# EAGLE design FPC (EAGLE 6.5.0)
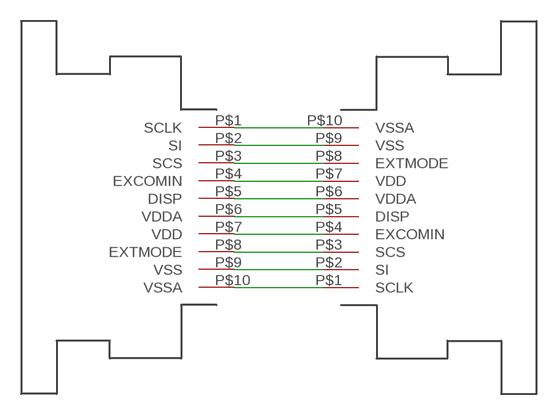
[diagram p0: schematic, sheet 1]

## Parts
U$1  52745-1097  [52745-1097]
U$2  52745-1097  [52745-1097]

## Nets
N$1: U$1.P$10(VSSA) U$2.P$1(SCLK)
N$2: U$1.P$9(VSS) U$2.P$2(SI)
N$3: U$1.P$8(EXTMODE) U$2.P$3(SCS)
N$4: U$1.P$7(VDD) U$2.P$4(EXCOMIN)
N$5: U$1.P$6(VDDA) U$2.P$5(DISP)
N$6: U$1.P$5(DISP) U$2.P$6(VDDA)
N$7: U$1.P$4(EXCOMIN) U$2.P$7(VDD)
N$8: U$1.P$3(SCS) U$2.P$8(EXTMODE)
N$9: U$1.P$2(SI) U$2.P$9(VSS)
N$10: U$1.P$1(SCLK) U$2.P$10(VSSA)

## Library data of the parts
U$1 U$2 = KW2:52745-1097

## Board
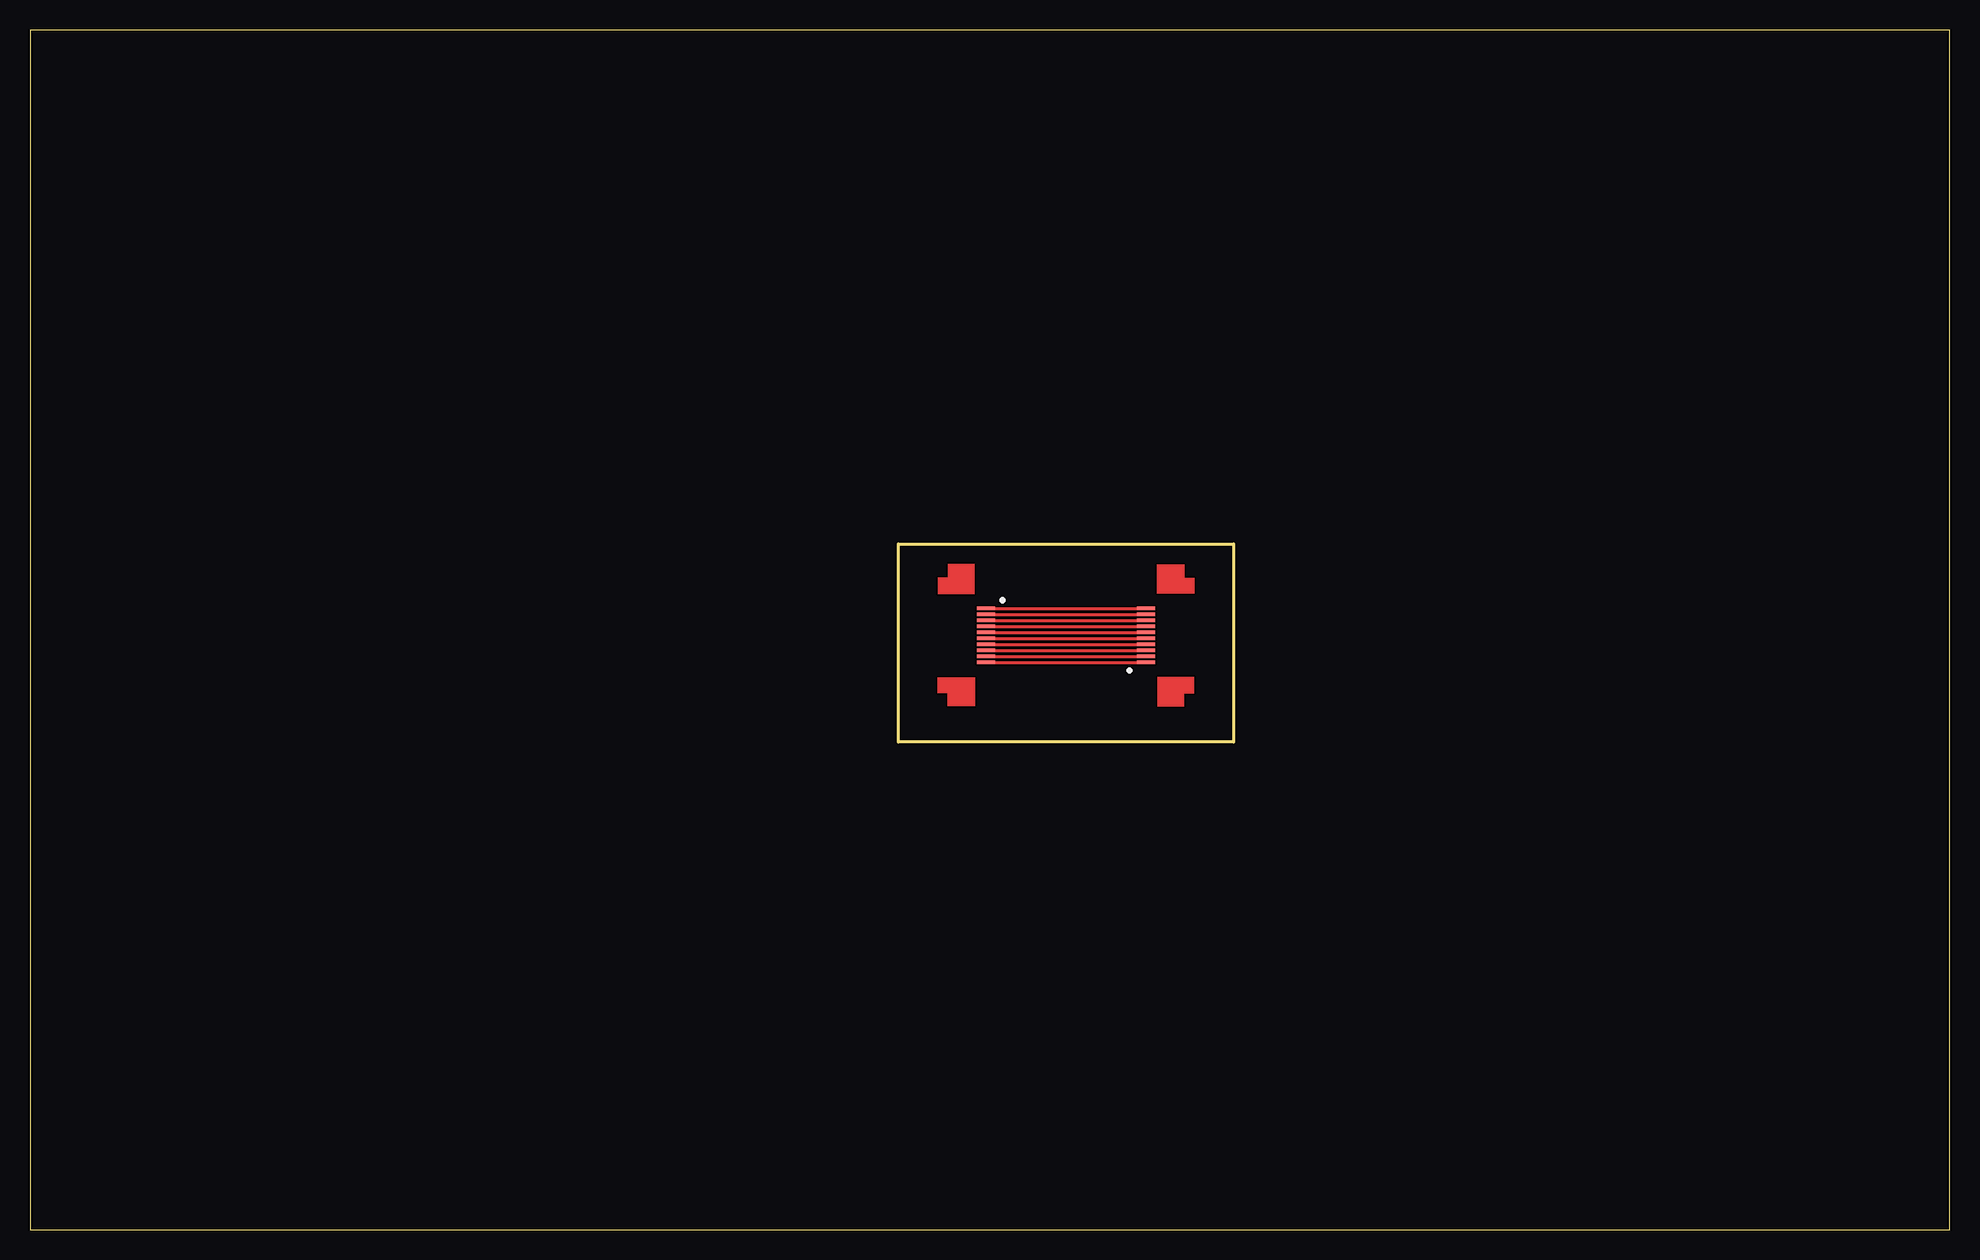
[diagram p1: board, top side]

Size 160 x 100 mm. Coordinates in mm from the lower left corner, seen from the top.
Outline: 0,0 160,0 160,100 0,100 0,0
Copper layers (1*16): Top 0.035mm / dielectric 1.5mm / Bottom 0.035mm
Design rules "default": minimum track width 10mil, minimum drill 24mil, track to track 8mil, track to pad 8mil, pad to pad 8mil, via to via 8mil, smd to smd 8mil, copper to edge 40mil, drill to drill 8mil, minimum pad ring 10mil, minimum via ring 8mil, stop-mask expansion 4mil, vias tented up to drill 0mil, thermal gap 10mil
Milling: 4 lines

### Footprints (pad centres in the part's own frame; a part is rotated, then mirrored left to right if it is on the bottom)
52745-1097 = smd 0.3 x 1.5: P$1 -2.25,0.95; P$2 -1.75,0.95; P$3 -1.25,0.95; P$4 -0.75,0.95; P$5 -0.25,0.95; P$6 0.25,0.95; P$7 0.75,0.95; P$8 1.25,0.95; P$9 1.75,0.95; P$10 2.25,0.95

### Placement (x,y rotation side)
U$1  93.98,49.53 90 top
U$2  78.74,49.53 270 top

### Tracks (layer width: path | path; a pad name or v marks a point on that pad's centre or on a via)
N$1
  Top 0.254: U$2.P$1 U$1.P$10
N$2
  Top 0.254: U$2.P$2 U$1.P$9
N$3
  Top 0.254: U$2.P$3 U$1.P$8
N$4
  Top 0.254: U$2.P$4 U$1.P$7
N$5
  Top 0.254: U$2.P$5 U$1.P$6
N$6
  Top 0.254: U$2.P$6 U$1.P$5
N$7
  Top 0.254: U$2.P$7 U$1.P$4
N$8
  Top 0.254: U$2.P$8 U$1.P$3
N$9
  Top 0.254: U$2.P$9 U$1.P$2
N$10
  Top 0.254: U$2.P$10 U$1.P$1